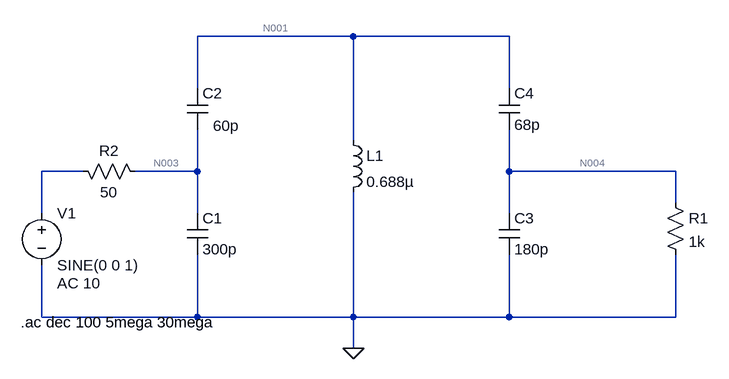
[diagram p0: schematic Draft1.asc]
Draft1.asc, the LTspice schematic file:
Version 4
SHEET 1 1000 788
WIRE 448 288 208 288
WIRE 688 288 448 288
WIRE 208 368 208 288
WIRE 688 368 688 288
WIRE 448 448 448 288
WIRE 32 496 -32 496
WIRE 208 496 208 432
WIRE 208 496 112 496
WIRE 688 496 688 432
WIRE 944 496 688 496
WIRE 944 544 944 496
WIRE -32 560 -32 496
WIRE 208 560 208 496
WIRE 688 560 688 496
WIRE -32 720 -32 640
WIRE 208 720 208 624
WIRE 208 720 -32 720
WIRE 448 720 448 528
WIRE 448 720 208 720
WIRE 688 720 688 624
WIRE 688 720 448 720
WIRE 944 720 944 624
WIRE 944 720 688 720
WIRE 448 768 448 720
FLAG 448 768 0
DATAFLAG 320 288 ""
DATAFLAG 912 496 ""
SYMBOL cap 192 560 R0
SYMATTR InstName C1
SYMATTR Value 300p
SYMBOL cap 192 368 R0
WINDOW 3 40 58 Left 2
SYMATTR Value 60p
SYMATTR InstName C2
SYMBOL cap 672 560 R0
SYMATTR InstName C3
SYMATTR Value 180p
SYMBOL cap 672 368 R0
SYMATTR InstName C4
SYMATTR Value 68p
SYMBOL ind 432 432 R0
SYMATTR InstName L1
SYMATTR Value 0.688µ
SYMBOL res 928 528 R0
SYMATTR InstName R1
SYMATTR Value 1k
SYMBOL res 128 512 M270
WINDOW 0 32 56 VTop 2
WINDOW 3 0 56 VBottom 2
SYMATTR InstName R2
SYMATTR Value 50
SYMBOL voltage -32 544 R0
WINDOW 123 24 124 Left 2
WINDOW 39 0 0 Left 0
SYMATTR Value2 AC 10
SYMATTR InstName V1
SYMATTR Value SINE(0 0 1)
TEXT -64 728 Left 2 !.ac dec 100 5mega 30mega

The netlist it stands for:
* Draft1.asc
C1 N003 0 300p
C2 N001 N003 60p
C3 N004 0 180p
C4 N001 N004 68p
L1 N001 0 0.688µ
R1 N004 0 1k
R2 N003 N002 50
V1 N002 0 SINE(0 0 1) AC 10
.ac dec 100 5mega 30mega
.backanno
.end

* Results of the author's LTspice run, read from the files saved beside the schematic
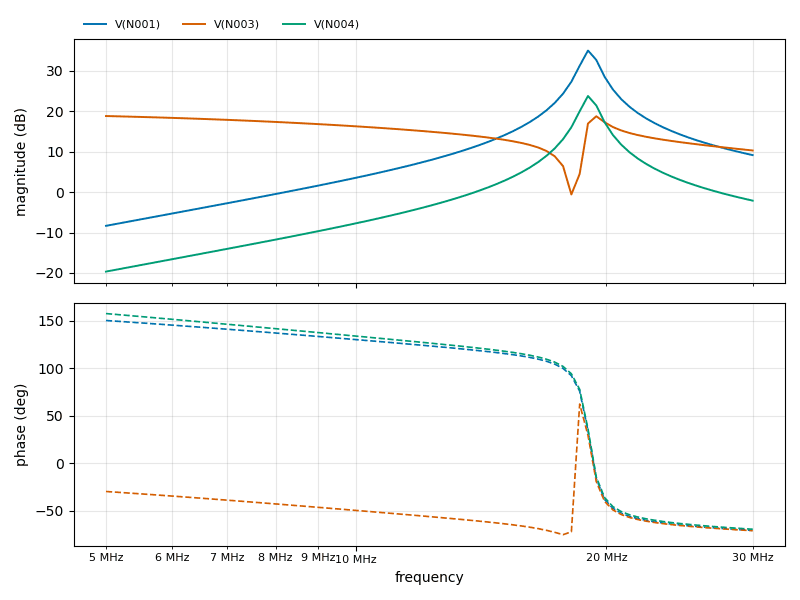
[diagram p1: AC Analysis of Draft1.asc, plotted from the saved traces]
* AC Analysis, 1 run:
*   V(N001): -8.35 dB at 5 MHz, 9.12 dB at 30 MHz, peak 34.97 dB at 19.01 MHz, 3 dB below the peak at 18.66 MHz and 19.53 MHz
*   V(N003): 18.78 dB at 5 MHz, 10.27 dB at 30 MHz, peak 18.78 dB at 5 MHz, 3 dB below the peak at 10.82 MHz
*   V(N004): -19.66 dB at 5 MHz, -2.12 dB at 30 MHz, peak 23.73 dB at 19.01 MHz, 3 dB below the peak at 18.66 MHz and 19.53 MHz